# Altium schematic sheet Debugger.SchDoc: Debugger (CoLinkEx)
size A4; Organization: Altium Limited; SheetNumber: 2; SheetTotal: 5; License: CC-BY-SA 3.0; Version: 0.1; Project: NeoCortex Alice
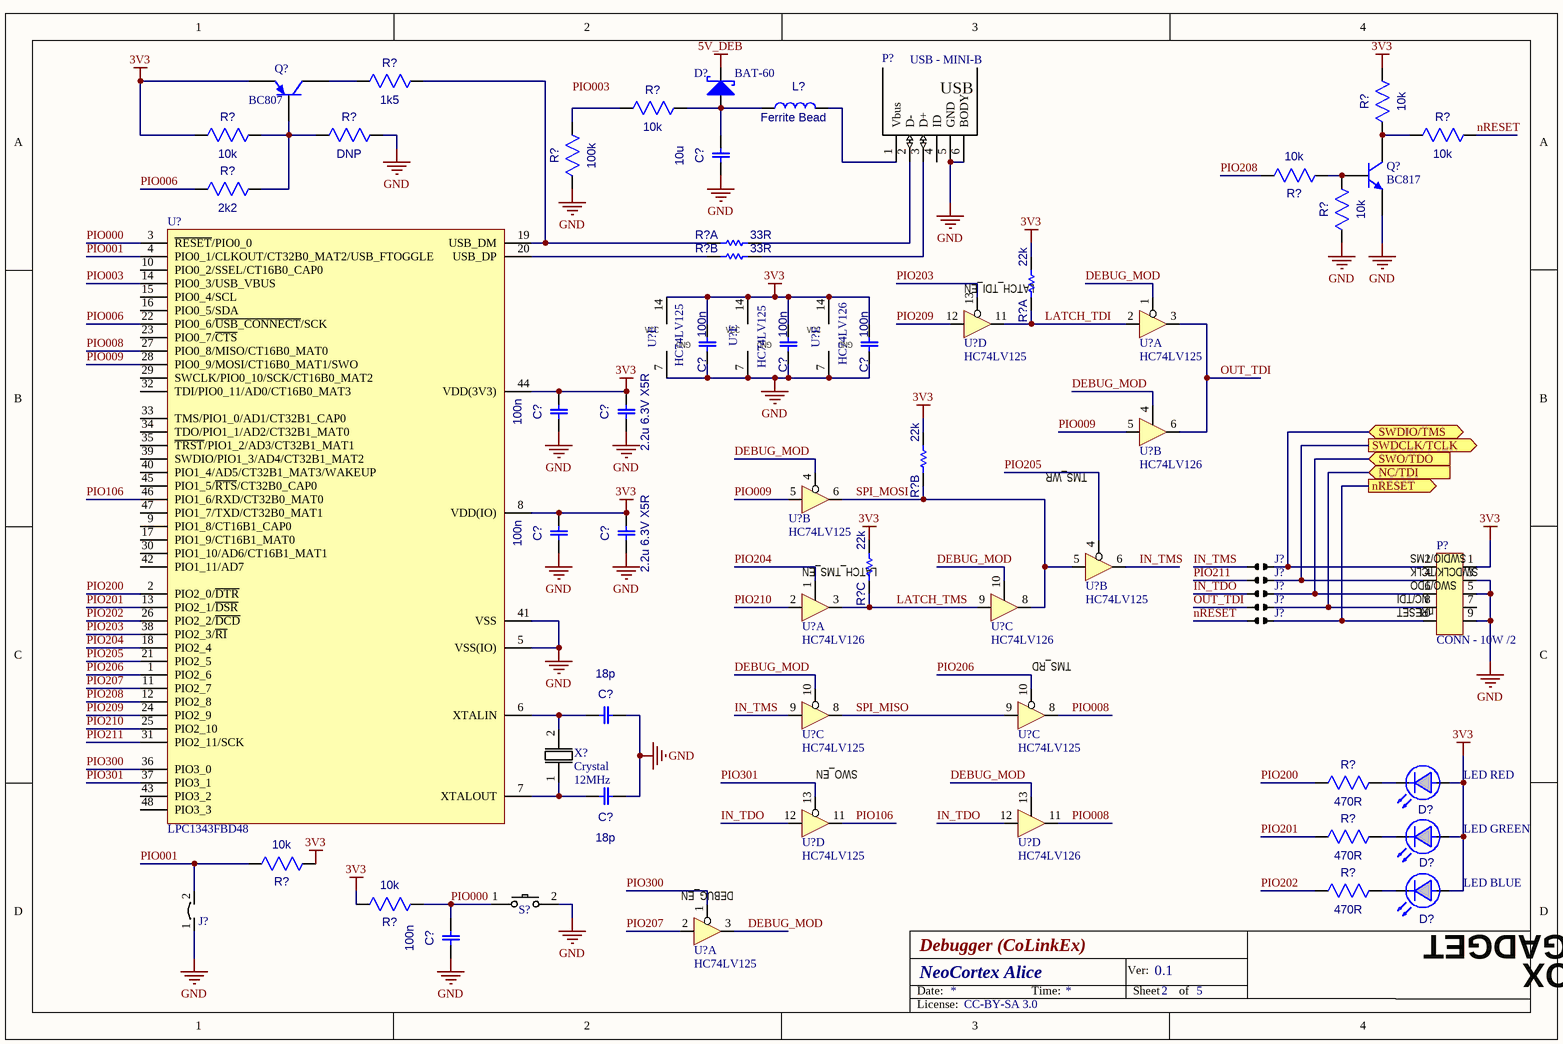
[diagram p0: Debugger.SchDoc]

## Parts
(Parts that share a designator on the sheet are numbered #1, #2 ... from top to bottom, then left to right.)
C?#1  10u  [CAP 0805]
C?#2  100n  [CAP 0603]
C?#3  100n  [CAP 0603]
C?#4  100n  [CAP 0603]
C?#5  100n  [CAP 0603]
C?#6  2.2u 6.3V X5R  [CAP 0603]
C?#7  100n  [CAP 0603]
C?#8  2.2u 6.3V X5R  [CAP 0805]
C?#9  18p  [CAP 0603]
C?#10  18p  [CAP 0603]
C?#11  100n  [CAP 0603]
D?#1  BAT-60  [SOD-323]
D?#2  LED RED  [LED 0603]
D?#3  LED GREEN  [LED 0603]
D?#4  LED BLUE  [LED 0603]
J?#1  Jumper-2w Solder  [JMP-Solder]  (value not drawn)
J?#2  Jumper-2w Solder  [JMP-Solder]  (value not drawn)
J?#3  Jumper-2w Solder  [JMP-Solder]  (value not drawn)
J?#4  Jumper-2w Solder  [JMP-Solder]  (value not drawn)
J?#5  Jumper-2w Solder  [JMP-Solder]  (value not drawn)
J?#6  Jumper-2w  [JMP-2W]  (value not drawn)
L?  Ferrite Bead  [IND 0603]
P?#1  USB - MINI-B  [USB - MINI-B SMD]
P?#2  CONN - 10W /2  [Header 10W /2 1.27mm]
Q?#1  BC807  [SOT-23]
Q?#2  BC817  [SOT-23]
R?#1  1k5  [RES 0603]
R?#2  10k  [RES 0603]
R?#3  10k  [RES 0603]
R?#4  DNP  [RES 0603]
R?#5  10k  [RES 0603]
R?#6  10k  [RES 0603]
R?#7  10k  [RES 0603]
R?#8  2k2  [RES 0603]
R?#9  100k  [RES 0603]
R?#10  33R  [RES ARRAY 0804]  (part A of 4)
R?#11  10k  [RES 0603]
R?#12  33R  [RES ARRAY 0804]  (part B of 4)
R?#13  22k  [RES ARRAY 0804]  (part A of 4)
R?#14  22k  [RES ARRAY 0804]  (part B of 4)
R?#15  22k  [RES ARRAY 0804]  (part C of 4)
R?#16  470R  [RES 0603]
R?#17  470R  [RES 0603]
R?#18  10k  [RES 0603]
R?#19  470R  [RES 0603]
R?#20  10k  [RES 0603]
S?  Push Button SPST  [Push Button Omron SPST]  (value not drawn)
U?#1  LPC1343FBD48  [LQFP-48]
U?#2  HC74LV125  [SOIC-14]  (part D of 5)
U?#3  HC74LV125  [SOIC-14]  (part A of 5)
U?#4  HC74LV125  [SOIC-14]  (part E of 5)
U?#5  HC74LV125  [SOIC-14]  (part E of 5)
U?#6  HC74LV126  [SOIC-14]  (part E of 5)
U?#7  HC74LV126  [SOIC-14]  (part B of 5)
U?#8  HC74LV125  [SOIC-14]  (part B of 5)
U?#9  HC74LV125  [SOIC-14]  (part B of 5)
U?#10  HC74LV126  [SOIC-14]  (part A of 5)
U?#11  HC74LV126  [SOIC-14]  (part C of 5)
U?#12  HC74LV125  [SOIC-14]  (part C of 5)
U?#13  HC74LV125  [SOIC-14]  (part C of 5)
U?#14  HC74LV125  [SOIC-14]  (part D of 5)
U?#15  HC74LV126  [SOIC-14]  (part D of 5)
U?#16  HC74LV125  [SOIC-14]  (part A of 5)
X?  Crystal  value 12MHz  [Crystal SMU4]

## Ports
NC/TDI (in), nRESET (out), SWDCLK/TCLK (out), SWDIO/TMS (bidir), SWO/TDO (in)

## Nets
3V3: C?#2.1 C?#3.1 C?#4.1 C?#5.2 C?#6.2 C?#7.2 C?#8.2 D?#2.1 D?#3.1 D?#4.1 P?#2.1 Q?#1.2(E) R?#3.2 R?#5.1 R?#13.8 R?#14.7 R?#15.6 R?#18.2 R?#20.1 U?#1.8(VDD(IO)) U?#1.44(VDD(3V3)) U?#4.14(VCC) U?#5.14(VCC) U?#6.14(VCC)
5V_DEB: D?#1.2(K)
GND: C?#1.1 C?#2.2 C?#3.2 C?#4.2 C?#5.1 C?#6.1 C?#7.1 C?#8.1 C?#9.2 C?#10.1 C?#11.1 J?#6.1 P?#1.5(GND) P?#1.6(BODY) P?#2.3 P?#2.5 P?#2.9 Q?#2.2(E) R?#4.1 R?#9.2 R?#11.2 S?.2 U?#1.5(VSS(IO)) U?#1.41(VSS) U?#4.7(GND) U?#5.7(GND) U?#6.7(GND)
DEBUG_MOD: U?#3.1 U?#7.4 U?#8.4 U?#11.10 U?#12.10 U?#15.13 U?#16.3
IN_TDO: J?#3.1 U?#14.12 U?#15.12
IN_TMS: J?#1.1 U?#9.6 U?#12.9
LATCH_TDI: R?#13.1 U?#2.11 U?#3.2
LATCH_TMS: R?#15.3 U?#10.3 U?#11.9
NC/TDI: J?#4.2 P?#2.8 ; port NC/TDI
nRESET: J?#5.1 R?#6.1
nRESET: J?#5.2 P?#2.10 ; port nRESET  [a separate net that carries the same name]
OUT_TDI: J?#4.1 U?#3.3 U?#7.6
PIO000: C?#11.2 R?#20.2 S?.1 U?#1.3(~{RESET}/PIO0_0)
PIO001: J?#6.2 R?#18.1 U?#1.4(PIO0_1/CLKOUT/CT32B0_MAT2/USB_FTOGGLE)
PIO003: U?#1.14(PIO0_3/USB_VBUS)
PIO006: R?#8.2 U?#1.22(PIO0_6/~{USB_CONNECT}/SCK)
PIO008: U?#1.27(PIO0_8/MISO/CT16B0_MAT0) U?#13.8 U?#15.11
PIO009: U?#1.28(PIO0_9/MOSI/CT16B0_MAT1/SWO) U?#7.5 U?#8.5
PIO106: U?#1.46(PIO1_6/RXD/CT32B0_MAT0) U?#14.11
PIO200: R?#16.2 U?#1.2(PIO2_0/~{DTR})
PIO201: R?#17.2 U?#1.13(PIO2_1/~{DSR})
PIO202: R?#19.2 U?#1.26(PIO2_2/~{DCD})
PIO203: U?#1.38(PIO2_3/~{RI}) U?#2.13
PIO204: U?#1.18(PIO2_4) U?#10.1
PIO205: U?#1.21(PIO2_5) U?#9.4
PIO206: U?#1.1(PIO2_6) U?#13.10
PIO207: U?#1.11(PIO2_7) U?#16.2
PIO208: R?#7.1 U?#1.12(PIO2_8)
PIO209: U?#1.24(PIO2_9) U?#2.12
PIO210: U?#1.25(PIO2_10) U?#10.2
PIO211: J?#2.1 U?#1.31(PIO2_11/SCK)
PIO300: U?#1.36(PIO3_0) U?#16.1
PIO301: U?#1.37(PIO3_1) U?#14.13
SPI_MISO: U?#12.8 U?#13.9
SPI_MOSI: R?#14.2 U?#8.6 U?#9.5 U?#11.8
SWDCLK/TCLK: J?#2.2 P?#2.4 ; port SWDCLK/TCLK
SWDIO/TMS: J?#1.2 P?#2.2 ; port SWDIO/TMS
SWO/TDO: J?#3.2 P?#2.6 ; port SWO/TDO
NetC?#1_2: C?#1.2 D?#1.1(A) L?.1 R?#2.1
NetC?#9_1: C?#9.1 U?#1.6(XTALIN) X?.2
NetC?#10_2: C?#10.2 U?#1.7(XTALOUT) X?.1
NetD?#2_2: D?#2.2 R?#16.1
NetD?#3_2: D?#3.2 R?#17.1
NetD?#4_2: D?#4.2 R?#19.1
NetL?_2: L?.2 P?#1.1(Vbus)
NetP?#1_2: P?#1.2(D-) R?#10.8
NetP?#1_3: P?#1.3(D+) R?#12.7
NetQ?#1_1: Q?#1.1(B) R?#3.1 R?#4.2 R?#8.1
NetQ?#1_3: Q?#1.3(C) R?#1.2
NetQ?#2_1: Q?#2.1(B) R?#7.2 R?#11.1
NetQ?#2_3: Q?#2.3(C) R?#5.2 R?#6.2
NetR?#1_1: R?#1.1 R?#10.1 U?#1.19(USB_DM)
NetR?#2_2: R?#2.2 R?#9.1
NetR?#12_2: R?#12.2 U?#1.20(USB_DP)

Not connected (* = marked no-connect by the designer): P?#1 4(ID); P?#2 7; U?#1 9(PIO1_8/CT16B1_CAP0) 10(PIO0_2/SSEL/CT16B0_CAP0) 15(PIO0_4/SCL) 16(PIO0_5/SDA) 17(PIO1_9/CT16B1_MAT0) 23(PIO0_7/~{CTS}) 29(SWCLK/PIO0_10/SCK/CT16B0_MAT2) 30(PIO1_10/AD6/CT16B1_MAT1) 32(TDI/PIO0_11/AD0/CT16B0_MAT3) 33(TMS/PIO1_0/AD1/CT32B1_CAP0) 34(TDO/PIO1_1/AD2/CT32B1_MAT0) 35(~{TRST}/PIO1_2/AD3/CT32B1_MAT1) 39(SWDIO/PIO1_3/AD4/CT32B1_MAT2) 40(PIO1_4/AD5/CT32B1_MAT3/WAKEUP) 42(PIO1_11/AD7) 43(PIO3_2) 45(PIO1_5/~{RTS}/CT32B0_CAP0) 47(PIO1_7/TXD/CT32B0_MAT1) 48(PIO3_3)

## Notes on the sheet
- (near U?#2) LATCH_TDI_EN
- TMS_WR
- (near U?#10) LATCH_TMS_EN
- (near P?#2) SWDIO/TMS
- (near P?#2) SWDCLK/TCLK
- (near P?#2) SWO/TDO
- (near P?#2) NC/TDI
- (near P?#2) nRESET
- (near U?#13) TMS_RD
- (near U?#14) SWO_EN
- (near U?#16) DEBUG_EN
- Labels drawn without touching a wire or pin: PIO003
- Date:
- Time:
- Ver:
- Sheet
- of
- GADGET
- SANDBOX
- License:
- (in symbol USB - MINI-B) USB

## Library data of the parts
C?#1-C?#11 = Capacitor Ceramic
  C?#1: Value: 10u
  C?#2-C?#5 C?#7 C?#11: Value: 100n
  C?#6 C?#8: Value: 2.2u 6.3V X5R
  C?#9 C?#10: Value: 18p
D?#1 = Diode Schottky: Schottky; Value: BAT54-G (SOT-23); DiodesInc: 1N5819 (SOD-123); DiodesInc2: BAT60 (SOD-323)
D?#2-D?#4 = LED
L? = Inductor: Value: Ferrite Bead
P?#1 = USB - MINI-B: USB OTG MINI-B
Q?#1 = Transistor PNP: NPN Bipolar Transistor; Comp1: BC807
Q?#2 = Transistor NPN: NPN Bipolar Transistor; Comp1: BC817
R?#1-R?#9 R?#11 R?#16-R?#20 = Resistor
  R?#1: Value: 1k5
  R?#2 R?#3 R?#5-R?#7 R?#11 R?#18 R?#20: Value: 10k
  R?#4: Value: DNP
  R?#8: Value: 2k2
  R?#9: Value: 100k
  R?#16 R?#17 R?#19: Value: 470R
R?#10 R?#12-R?#15 = Resistor Array 4w
  R?#10 R?#12: Value: 33R
  R?#13-R?#15: Value: 22k
U?#1 = LPC1343: 32-bit ARM Cortex-M3 microcontroller; up to 32 kB flash and  8 kB SRAM; USB device; LQFP: LPC1343FBD48
U?#2-U?#5 U?#8 U?#9 U?#12-U?#14 U?#16 = HC74LV125: Buffer/Line Driver Quad Non-Inverting
U?#6 U?#7 U?#10 U?#11 U?#15 = HC74LV126: Buffer/Line Driver Quad Non-Inverting